# Altium schematic sheet Copy of Schematic.SchDoc
size Letter; SheetNumber: 1; SheetTotal: 1
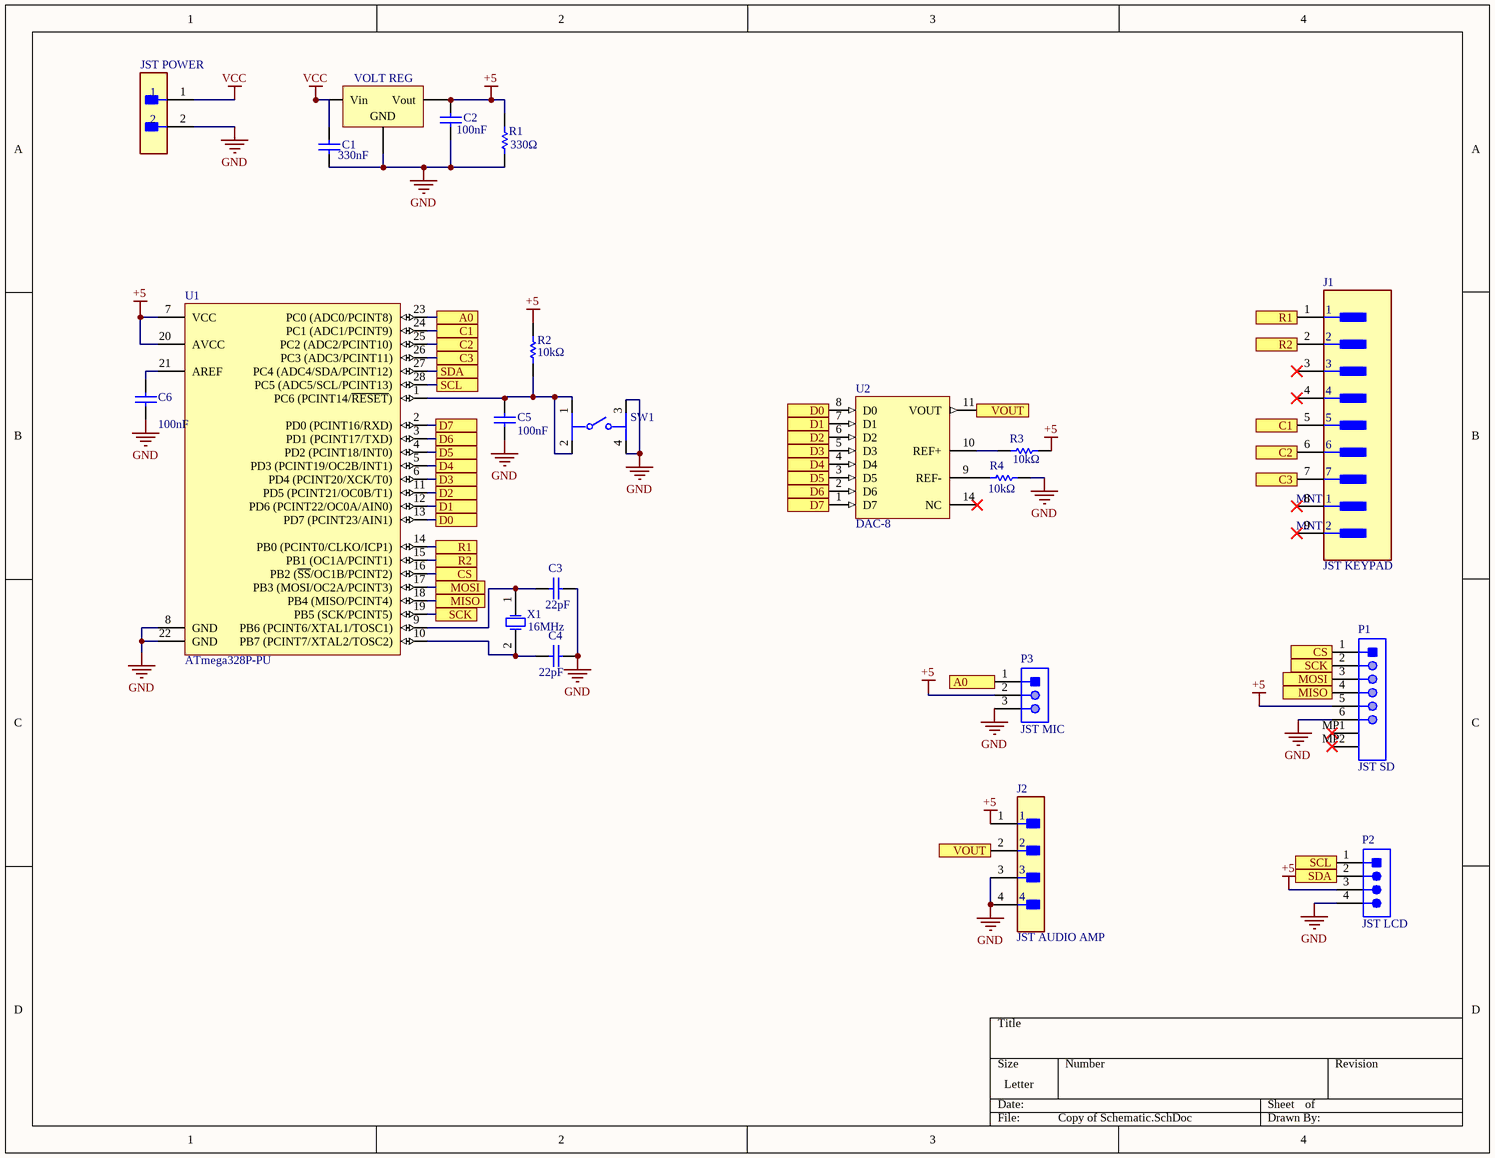
[diagram p0: Copy of Schematic.SchDoc]

## Parts
C1  value 330nF  [RAD-0.3]  (hidden comment: Cap)
C2  value 100nF  [RAD-0.3]  (hidden comment: Cap)
C3  value 22pF  [RAD-0.3]  (hidden comment: Cap)
C4  value 22pF  [RAD-0.3]  (hidden comment: Cap)
C5  value 100nF  [RAD-0.3]  (hidden comment: Cap)
C6  value 100nF  [RAD-0.3]  (hidden comment: Cap)
J1  JST KEYPAD  [FP-B7B-ZR-SM4-TF_LF_SN-MFG]
J2  JST AUDIO AMP  [FP-B04B-XASK-1_LF_SN-MFG]
JST_POWER  (no value)  [FP-B2B-XH-A_LF_SN-MFG]
P1  JST SD  [JST-S6B-PH-SM4-TB(LF)(SN)_V]
P2  JST LCD  [JST-B4P-VH(LF)(SN)_V]
P3  JST MIC  [JST-B3P-VH(LF)(SN)-3_V]
R1  value 330Ω  [AXIAL-0.3]  (hidden comment: Res1)
R2  value 10kΩ  [AXIAL-0.3]  (hidden comment: Res1)
R3  value 10kΩ  [AXIAL-0.3]  (hidden comment: Res1)
R4  value 10kΩ  [AXIAL-0.3]  (hidden comment: Res1)
SW1  B3FS-1012P  [FP-B3FS-1012P-MFG]  (value not drawn)
U1  ATmega328P-PU  [28P3]
U2  DAC-8  [SOT402-1_N]
VOLT_REG  (no value)  [D2PAK_N]
X1  16MHz  [FOX-FOXSDLF160-20_V]

## Ports
A0, C1, C2, C3, CS, D0, D1, D2, D3, D4, D5, D6, D7, MISO, MOSI, R1, R2, SCK, SCL, SDA, VOUT

## Nets
+5: C2.2 J2.1 P1.5 P2.3 P3.2 R1.2 R2.2 R3.2 U1.7(VCC) U1.20(AVCC) VOLT_REG.3(Vout)
GND: C1.2 C2.1 C3.1 C4.2 C5.1 C6.1 J2.3 J2.4 JST_POWER.2 P1.6 P2.4 P3.3 R1.1 R4.2 SW1.3 SW1.4 U1.8(GND) U1.22(GND) U2.12(GND) VOLT_REG.2(GND)
VCC: C1.1 JST_POWER.1 U2.13(VCC) VOLT_REG.1(Vin)
A0: P3.1 U1.23(PC0_(ADC0/PCINT8)) ; port A0
C1: J1.5 U1.24(PC1_(ADC1/PCINT9)) ; port C1
C2: J1.6 U1.25(PC2_(ADC2/PCINT10)) ; port C2
C3: J1.7 U1.26(PC3_(ADC3/PCINT11)) ; port C3
CS: P1.1 U1.16(PB2_(~{SS}/OC1B/PCINT2)) ; port CS
D0: U1.13(PD7_(PCINT23/AIN1)) U2.8(D0) ; port D0
D1: U1.12(PD6_(PCINT22/OC0A/AIN0)) U2.7(D1) ; port D1
D2: U1.11(PD5_(PCINT21/OC0B/T1)) U2.6(D2) ; port D2
D3: U1.6(PD4_(PCINT20/XCK/T0)) U2.5(D3) ; port D3
D4: U1.5(PD3_(PCINT19/OC2B/INT1)) U2.4(D4) ; port D4
D5: U1.4(PD2_(PCINT18/INT0)) U2.3(D5) ; port D5
D6: U1.3(PD1_(PCINT17/TXD)) U2.2(D6) ; port D6
D7: U1.2(PD0_(PCINT16/RXD)) U2.1(D7) ; port D7
MISO: P1.4 U1.18(PB4_(MISO/PCINT4)) ; port MISO
MOSI: P1.3 U1.17(PB3_(MOSI/OC2A/PCINT3)) ; port MOSI
R1: J1.1 U1.14(PB0_(PCINT0/CLKO/ICP1)) ; port R1
R2: J1.2 U1.15(PB1_(OC1A/PCINT1)) ; port R2
SCK: P1.2 U1.19(PB5_(SCK/PCINT5)) ; port SCK
SCL: P2.1 U1.28(PC5_(ADC5/SCL/PCINT13)) ; port SCL
SDA: P2.2 U1.27(PC4_(ADC4/SDA/PCINT12)) ; port SDA
VOUT: J2.2 U2.11(VOUT) ; port VOUT
NetC3_2: C3.2 U1.9(PB6_(PCINT6/XTAL1/TOSC1)) X1.1(X1)
NetC4_1: C4.1 U1.10(PB7_(PCINT7/XTAL2/TOSC2)) X1.2(X2)
NetC5_2: C5.2 R2.1 SW1.1 SW1.2 U1.1(PC6_(PCINT14/~{RESET}))
NetC6_2: C6.2 U1.21(AREF)
NetR3_1: R3.1 U2.10(REF+)
NetR4_1: R4.1 U2.9(REF-)

Not connected (* = marked no-connect by the designer): J1 3* 4* 8(MNT_1)* 9(MNT_2)*; P1 MP1* MP2*; U2 14(NC)*

## Library data of the parts
C1-C6 = Cap: Capacitor; Published: 8-Jun-2000; LatestRevisionDate: 17-Jul-2002; LatestRevisionNote: Re-released for DXP Platform.; PackageReference: RAD-0.3; Publisher: Altium Limited; PackageDescription: Radial Cap, Thru-Hole; 2 Leads; 0.3 in Pin Spacing
J1 = CMP-17439-000021-1: CONN HEADER SMD 7POS 1.5MM; Manufacturer Part Number: B7B-ZR-SM4-TF(LF)(SN)(P); Number Of Contacts: 7; Conn Gender: Male; Voltage Rating: 50V; Conn Orientation: Straight; Current Rating: 1A; Temperature Range High: +85°C; Pitch: 1.5mm; Automotive: No; Contact Material: Tin,Copper; Manufacturer: JST; Temperature Range Low: -25°C; Device Class L3: unset; RoHS: TRUE; Number Of Rows: 1; Package: B7B-ZR-SM4-TF(LF)(SN)(P); ComponentLink2URL: http://www.jst-mfg.com/product/pdf/eng/eZH.pdf; Digikey Description: CONN HEADER SMD 7POS 1.5MM; Category: Conn; Lead Free: Yes; Temperature: -25°C to +85°C; ComponentLink2Description: Datasheet; Octopart: https://octopart.com/b7b-zr-sm4-tf%28lf%29%28sn%29%28p%29-jst-19182389; Device Class L2: Headers and Wire Housings; Height: 5mm; Device Class L1: Connectors
J2 = CMP-17439-000018-1: CONN HEADER VERT 4POS 2.5MM; Manufacturer Part Number: B04B-XASK-1(LF)(SN); Current Rating: 3A; Voltage Rating: 250V; Conn Orientation: Straight; Conn Gender: Male; Number Of Contacts: 4; ComponentLink2Description: Datasheet; Package: B04B-XASK-1(LF)(SN); Octopart: https://octopart.com/b04b-xask-1%28lf%29%28sn%29-jst-3990149; Pitch: 2.5mm; Device Class L1: Connectors; RoHS: TRUE; Device Class L3: unset; Temperature Range High: +85°C; Height: 8.8mm; Lead Free: Yes; Manufacturer: JST; Category: Conn; Temperature: -25°C to +85°C; Digikey Description: CONN HEADER VERT 4POS 2.5MM; Temperature Range Low: -25°C; ComponentLink2URL: http://www.jst-mfg.com/product/pdf/eng/eXA1.pdf; Contact Material: Tin,Copper; Device Class L2: Headers and Wire Housings; Automotive: No; Number Of Rows: 1
JST_POWER = CMP-2000-05888-3: CONN HEADER VERT 2POS 2.5MM; Current Rating: 3A; Voltage Rating: 250V; Number of Contacts: 2; Contact Resistance: 20mR; Wire/Cable Gauge: 22AWG; Insulation Resistance: 1GR; Connector Type: Male Pin; Packaging: Bulk; Contact Material: Brass; Lead Free: Lead Free; Orientation: Straight; Contact Plating: Tin; Max Current Rating: 3A; Termination: Solder; Fastening Type: Detent; Depth: 5.75mm; Housing Material: Polyamide; REACH SVHC: No SVHC; Series: XH; Voltage Rating (AC): 250V; Number of Positions: 2; Color: Natural; Contact Type: Male Pin; Max Voltage Rating (DC): 250V; Pitch: 2.5mm; Lead Pitch: 2.5mm; Mount: Through Hole; Max Operating Temperature: 85°C; Length: 7.4mm; Max Voltage Rating (AC): 250V; Min Operating Temperature: -25°C; Number of Rows: 1; Housing Color: White
P1 = CMP-2000-07027-1: Male Header, Pitch 2 mm, 1 x 6 Position, Height 5.5 mm, -25 to 85 degC; Pitch: 2mm; Style/Orientation: RightAngleHeader/Plug; No of Positions: 6; Package Reference: S6B-PH-SM4-TB(LF)(SN); Type: ShroudedHeader; Package Description: Male Header, Pitch 2 mm, 1 x 6 Position, Height 5.5 mm; Mounting Technology: SurfaceMount; Datasheet Version: 11/2008; Manufacturer: JST; Termination: Solder; Datasheet URL: https://datasheet.ciiva.com/11747/0900766b80df0d9d-11747278.pdf; Manufacturer URL: http://www.jst.com/home2.html
P2 = CMP-2000-05905-1: Male Header, Pitch 3.96 mm, 1 x 4 Position, Height 10.9 mm, Tail Length 3.7 mm, -25 to 85 degC, RoHS, Bulk; Pitch: 3.96mm; Style/Orientation: StraightHeader/Plug; No of Positions: 4; Manufacturer: JST; Termination: Solder; Package Description: Male Header, Pitch 3.96 mm, 1 x 4 Position, Height 10.9 mm, Tail Length 3.7 mm; Manufacturer URL: http://www.jst.com/home2.html; Datasheet Version: 05/2016; Mounting Technology: ThroughHole; Package Reference: B4P-VH(LF)(SN); Type: LockingHeader; Datasheet URL: http://www.jst-mfg.com/product/pdf/eng/eVH.pdf
P3 = CMP-1755-00003-1: Male Header, Pitch 3.96 mm, 1 x 3 Position, Height 10.9 mm, Tail Length 3.7 mm, -25 to 85 degC, RoHS, Bulk; PackageReference: B3P-VH(LF)(SN); ComponentLink2Description: Datasheet; ComponentLink2URL: http://www.jst-mfg.com/product/pdf/eng/eVH.pdf; DatasheetVersion: May-16; PackageDescription: Male Header, Pitch 3.96 mm, 1 x 3 Position, Height 10.9 mm, Tail Length 3.7 mm; ComponentLink1URL: http://www.jst.com/home2.html; ComponentLink1Description: Manufacturer URL
R1-R4 = Res1: Resistor; Published: 8-Jun-2000; LatestRevisionDate: 17-Jul-2002; LatestRevisionNote: Re-released for DXP Platform.; PackageReference: AXIAL-0.3; Publisher: Altium Limited; PackageDescription: Axial Device, Thru-Hole; 2 Leads; 0.3 in Pin Spacing
SW1 = CMP-08834-000024-1: SWITCH TACTILE SPST-NO 0.05A 24V; Actuator Length: 1.7mm; Operating Force: 1.47N; Actuator Type: Standard; Switch Function: Off-Mom; Switch Travel: 0.25mm; Mechanical Life: 300000Cycles; Max Current Rating: 50mA; Illumination Type: Non-Illuminated; Throw Configuration: SPST; Contact Resistance: 100mR; Actuator Color: Beige; Package Quantity: 1; Voltage Rating (DC): 24V; Series: B3FS; Max Voltage Rating (DC): 24V; Orientation: Straight; Termination: Gull Wing; Min Operating Temperature: -20°C; Case/Package: SMD/SMT; Weight: 0.2g; Max Operating Temperature: 70°C; RoHS Compliant: Yes; Depth: 8mm; Mount: Surface Mount; Current Rating: 50mA; Radiation Hardening: No; Length: 6.3mm; Contact Plating: Silver; Packaging: Tape and Reel; Electrical Life: 300000Cycles
U1 = CMP-0095-00013-2: 8-bit AVR Microcontroller, 32KB Flash, 1KB EEPROM, 2KB SRAM, 28-pin PDIP, Industrial Grade (-40°C to 85°C); RevisionNote: DatasheetVersion updated. URLs added.; PackageVersion: revB, Sep-2001; PackageDescription: 28-lead (0.300"/7.62mm Wide) Plastic Dual Inline Package (PDIP); DatasheetVersion: revD, May-2011; ComponentLink1Description: Manufacturer URL; ComponentLink1URL: http://www.atmel.com/; PackageReference: 28P3; ComponentLink2Description: ATmega48A/48PA/88A/88PA/168A/168PA/328/328P Datasheet; ComponentLink3URL: http://www.atmel.com/dyn/resources/prod_documents/8271S.pdf; ComponentLink2URL: http://www.atmel.com/dyn/resources/prod_documents/8271.pdf; ComponentLink3Description: ATmega48A/48PA/88A/88PA/168A/168PA/328/328P Summary
U2 = DAC-8: Generic 8-Bit D/A Converter; Published: 8-Jun-2000; LatestRevisionDate: 29-May-2009; LatestRevisionNote: IPC-7351 Footprint Added.; PackageVersion: Mar-2002; PackageReference: SOT402-1; Publisher: Altium Limited; PackageDescription: 14-Pin Thin Small Outline Package 0.65 mm Pitch; Code_JEDEC: MO-153
VOLT_REG = Volt Reg: Voltage Regulator; Published: 24-Mar-1999; LatestRevisionDate: 29-May-2009; LatestRevisionNote: IPC-7351 Footprint Added.; PackageReference: D2PAK; Publisher: Altium Limited; PackageDescription: 3-Pin Transistor Outline Package 2.54 mm Pitch, 15.1 mm Lead Span
X1 = CMP-1749-00001-1: Resistance Weld SMD Crystal, 16 MHz, +/- 30 ppm, 20 pF, -20 to 70 degC, 2-Pin SMD, RoHS, Tape and Reel; Output Current: 3 mA; Case\Package: SOT-553-6; Min Supply Voltage (DC): 4 V; Max Supply Voltage: 3.3 V; Min Supply Voltage: 1.4 V; Interface: I2C; Max Supply Voltage (DC): 6 V; ComponentLink2Description: Datasheet; REACH SVHC: No SVHC; ComponentLink1URL: http://www.foxonline.com/; ComponentLink2URL: http://foxonline.com/pdfs/hc49sdlf.pdf; Pins: 6; Packaging: Cut Tape; ComponentLink1Description: Manufacturer URL; Weight: 9.9E-05 oz; Length: 1.6 mm; RoHSCompliant: true; Min Operating Temperature: -55 degC; Radiation Hardening: No; PackageDescription: 2-Pin Surface Mount Device, Body 5 x 11.7 mm, Height 4.5 mm; Package Quantity: 1; Width: 1.2 mm; DatasheetVersion: Mar-15; Max Operating Temperature: 150 degC; Mount: Surface Mount; PackageReference: FOX-FOXSDLF160-20; Height: 0.55 mm